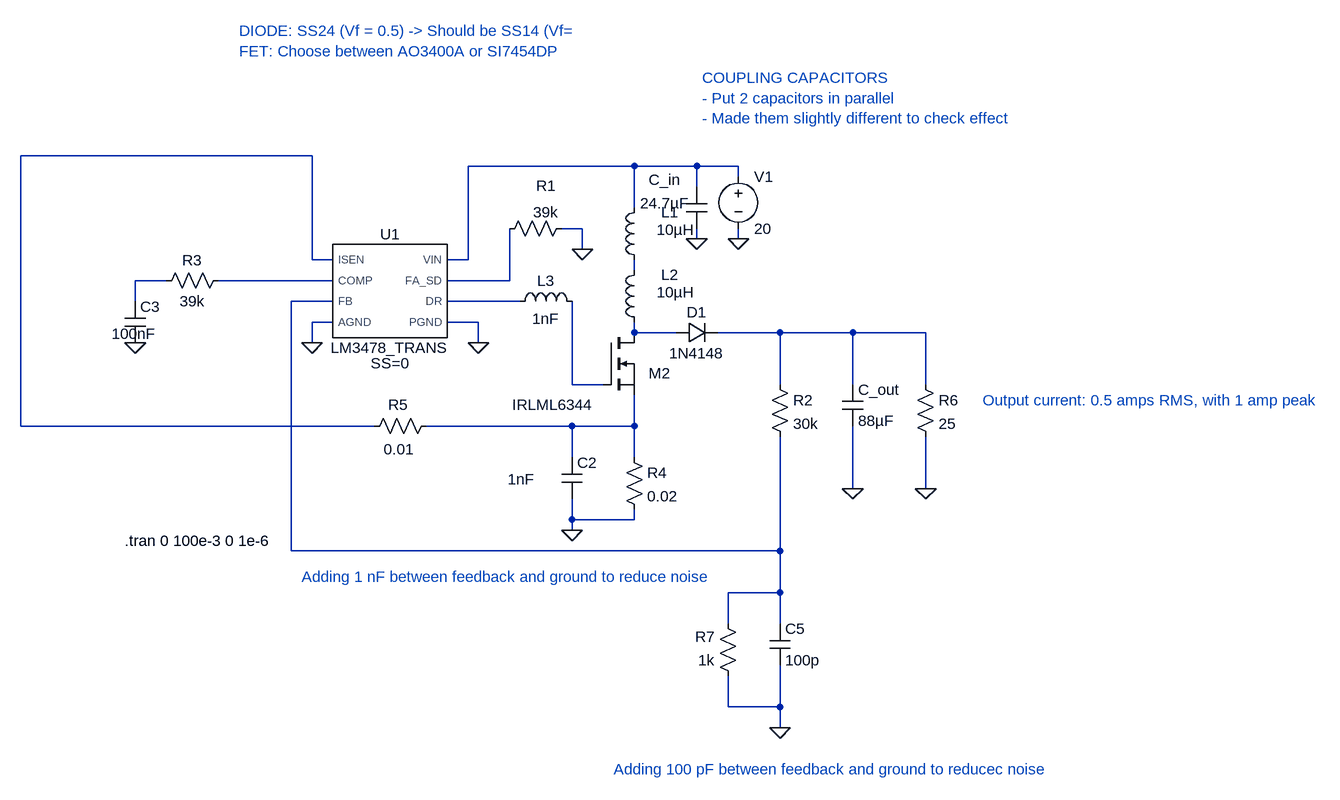
[diagram p0: schematic boost_20V.asc]
boost_20V.asc, the LTspice schematic file:
Version 4
SHEET 1 1524 1396
WIRE -240 -80 -688 -80
WIRE 256 -64 0 -64
WIRE 352 -64 256 -64
WIRE 416 -64 352 -64
WIRE 416 -48 416 -64
WIRE 352 -32 352 -64
WIRE 256 0 256 -64
WIRE 176 32 144 32
WIRE 352 48 352 32
WIRE 416 48 416 32
WIRE 176 64 176 32
WIRE -240 80 -240 -80
WIRE -208 80 -240 80
WIRE 0 80 0 -64
WIRE 0 80 -32 80
WIRE 256 96 256 80
WIRE -464 112 -512 112
WIRE -208 112 -384 112
WIRE 64 112 64 32
WIRE 64 112 -32 112
WIRE -512 144 -512 112
WIRE -208 144 -272 144
WIRE 80 144 -32 144
WIRE -208 176 -240 176
WIRE 16 176 -32 176
WIRE 256 192 256 176
WIRE 320 192 256 192
WIRE 480 192 384 192
WIRE 592 192 480 192
WIRE 704 192 592 192
WIRE -240 208 -240 176
WIRE 16 208 16 176
WIRE 160 272 160 144
WIRE 208 272 160 272
WIRE 480 272 480 192
WIRE 592 272 592 192
WIRE 704 272 704 192
WIRE -688 336 -688 -80
WIRE -144 336 -688 336
WIRE 160 336 -64 336
WIRE 256 336 256 288
WIRE 256 336 160 336
WIRE 160 384 160 336
WIRE 256 384 256 336
WIRE 592 432 592 336
WIRE 704 432 704 352
WIRE 160 480 160 448
WIRE 256 480 256 464
WIRE 256 480 160 480
WIRE 160 496 160 480
WIRE -272 528 -272 144
WIRE 480 528 480 352
WIRE 480 528 -272 528
WIRE 480 592 480 528
WIRE 480 592 400 592
WIRE 400 640 400 592
WIRE 480 640 480 592
WIRE 400 768 400 720
WIRE 480 768 480 704
WIRE 480 768 400 768
WIRE 480 800 480 768
FLAG 176 64 0
FLAG -240 208 0
FLAG 16 208 0
FLAG 160 496 0
FLAG 704 432 0
FLAG 416 48 0
FLAG 352 48 0
FLAG 592 432 0
FLAG 480 800 0
FLAG -512 208 0
SYMBOL ind 272 96 R180
WINDOW 0 -52 89 Left 2
WINDOW 3 -76 62 Left 2
SYMATTR InstName L1
SYMATTR Value 10µH
SYMATTR SpiceLine Rser=0.03
SYMBOL res 48 48 R270
WINDOW 0 66 72 VTop 2
WINDOW 3 57 72 VBottom 2
SYMATTR InstName R1
SYMATTR Value 39k
SYMBOL diode 320 208 R270
WINDOW 0 32 32 VTop 2
WINDOW 3 0 32 VBottom 2
SYMATTR InstName D1
SYMATTR Value 1N4148
SYMBOL cap 576 272 R0
SYMATTR InstName C_out
SYMATTR Value 88µF
SYMBOL res 464 256 R0
SYMATTR InstName R2
SYMATTR Value 30k
SYMBOL cap 144 384 R0
WINDOW 3 -83 34 Left 2
SYMATTR Value 1nF
SYMATTR InstName C2
SYMBOL res 240 368 R0
SYMATTR InstName R4
SYMATTR Value 0.02
SYMBOL res 688 256 R0
SYMATTR InstName R6
SYMATTR Value 25
SYMBOL voltage 416 -64 R0
WINDOW 123 0 0 Left 0
WINDOW 39 0 0 Left 0
SYMATTR InstName V1
SYMATTR Value 20
SYMBOL cap 336 -32 R0
WINDOW 0 -58 -11 Left 2
WINDOW 3 -71 25 Left 2
SYMATTR InstName C_in
SYMATTR Value 24.7µF
SYMBOL cap 464 640 R0
SYMATTR InstName C5
SYMATTR Value 100p
SYMBOL res 416 736 R180
WINDOW 0 36 76 Left 2
WINDOW 3 36 40 Left 2
SYMATTR InstName R7
SYMATTR Value 1k
SYMBOL cap -528 144 R0
WINDOW 3 -20 50 Left 2
SYMATTR Value 100nF
SYMATTR InstName C3
SYMBOL res -368 96 R90
WINDOW 0 0 56 VBottom 2
WINDOW 3 32 56 VTop 2
SYMATTR InstName R3
SYMATTR Value 39k
SYMBOL res -160 352 R270
WINDOW 0 33 53 VTop 2
WINDOW 3 -4 54 VBottom 2
SYMATTR InstName R5
SYMATTR Value 0.01
SYMBOL ind 64 160 R270
WINDOW 0 32 56 VTop 2
WINDOW 3 5 56 VBottom 2
SYMATTR InstName L3
SYMATTR Value 1nF
SYMATTR SpiceLine Rser=10
SYMBOL nmos 208 192 R0
WINDOW 0 70 63 Left 2
WINDOW 3 -140 111 Left 2
SYMATTR InstName M2
SYMATTR Value IRLML6344
SYMBOL ind 272 192 R180
WINDOW 0 -52 89 Left 2
WINDOW 3 -76 62 Left 2
SYMATTR InstName L2
SYMATTR Value 10µH
SYMATTR SpiceLine Rser=0.03
SYMBOL LM3478_TRANS -128 128 R0
SYMATTR InstName U1
TEXT -528 512 Left 2 !.tran 0 100e-3 0 1e-6
TEXT -352 -272 Left 2 ;DIODE: SS24 (Vf = 0.5) -> Should be SS14 (Vf=\nFET: Choose between AO3400A or SI7454DP
TEXT 224 864 Left 2 ;Adding 100 pF between feedback and ground to reducec noise
TEXT -256 568 Left 2 ;Adding 1 nF between feedback and ground to reduce noise
TEXT 792 296 Left 2 ;Output current: 0.5 amps RMS, with 1 amp peak
TEXT 360 -200 Left 2 ;COUPLING CAPACITORS\n- Put 2 capacitors in parallel\n- Made them slightly different to check effect

The netlist it stands for:
* boost_20V.asc
L1 N003 N002 10µH Rser=0.03
R1 N006 0 39k
D1 N009 N010 1N4148
C_out N010 0 88µF
R2 N010 N007 30k
C2 N012 0 1nF
R4 N012 0 0.02
R6 N010 0 25
V1 N002 0 20
C_in N002 0 24.7µF
C5 N007 0 100p
R7 0 N007 1k
C3 N004 0 100nF
R3 N005 N004 39k
R5 N001 N012 0.01
L3 N008 N011 1nF Rser=10
M2 N009 N011 N012 N012 IRLML6344
L2 N009 N003 10µH Rser=0.03
XU1 0 N005 N008 N006 N007 N001 0 N002 LM3478_TRANS SS=0  ; pins AGND COMP DR FA_SD FB ISEN PGND VIN
.model D D
.lib standard.dio
.model NMOS NMOS
.model PMOS PMOS
.lib standard.mos
.tran 0 100e-3 0 1e-6
* DIODE: SS24 (Vf = 0.5) -> Should be SS14 (Vf=
* FET: Choose between AO3400A or SI7454DP
* Adding 100 pF between feedback and ground to reducec noise
* Adding 1 nF between feedback and ground to reduce noise
* Output current: 0.5 amps RMS, with 1 amp peak
* COUPLING CAPACITORS
* - Put 2 capacitors in parallel
* - Made them slightly different to check effect
.lib C:\users\iwolfs\Favorites\acoustic-material-characterization\acoustic-piezodriver-hw\simulations\libs\LM3478_TRANS.lib
.backanno
.end